# EAGLE design BPM_ver1 (EAGLE 9.6.2)
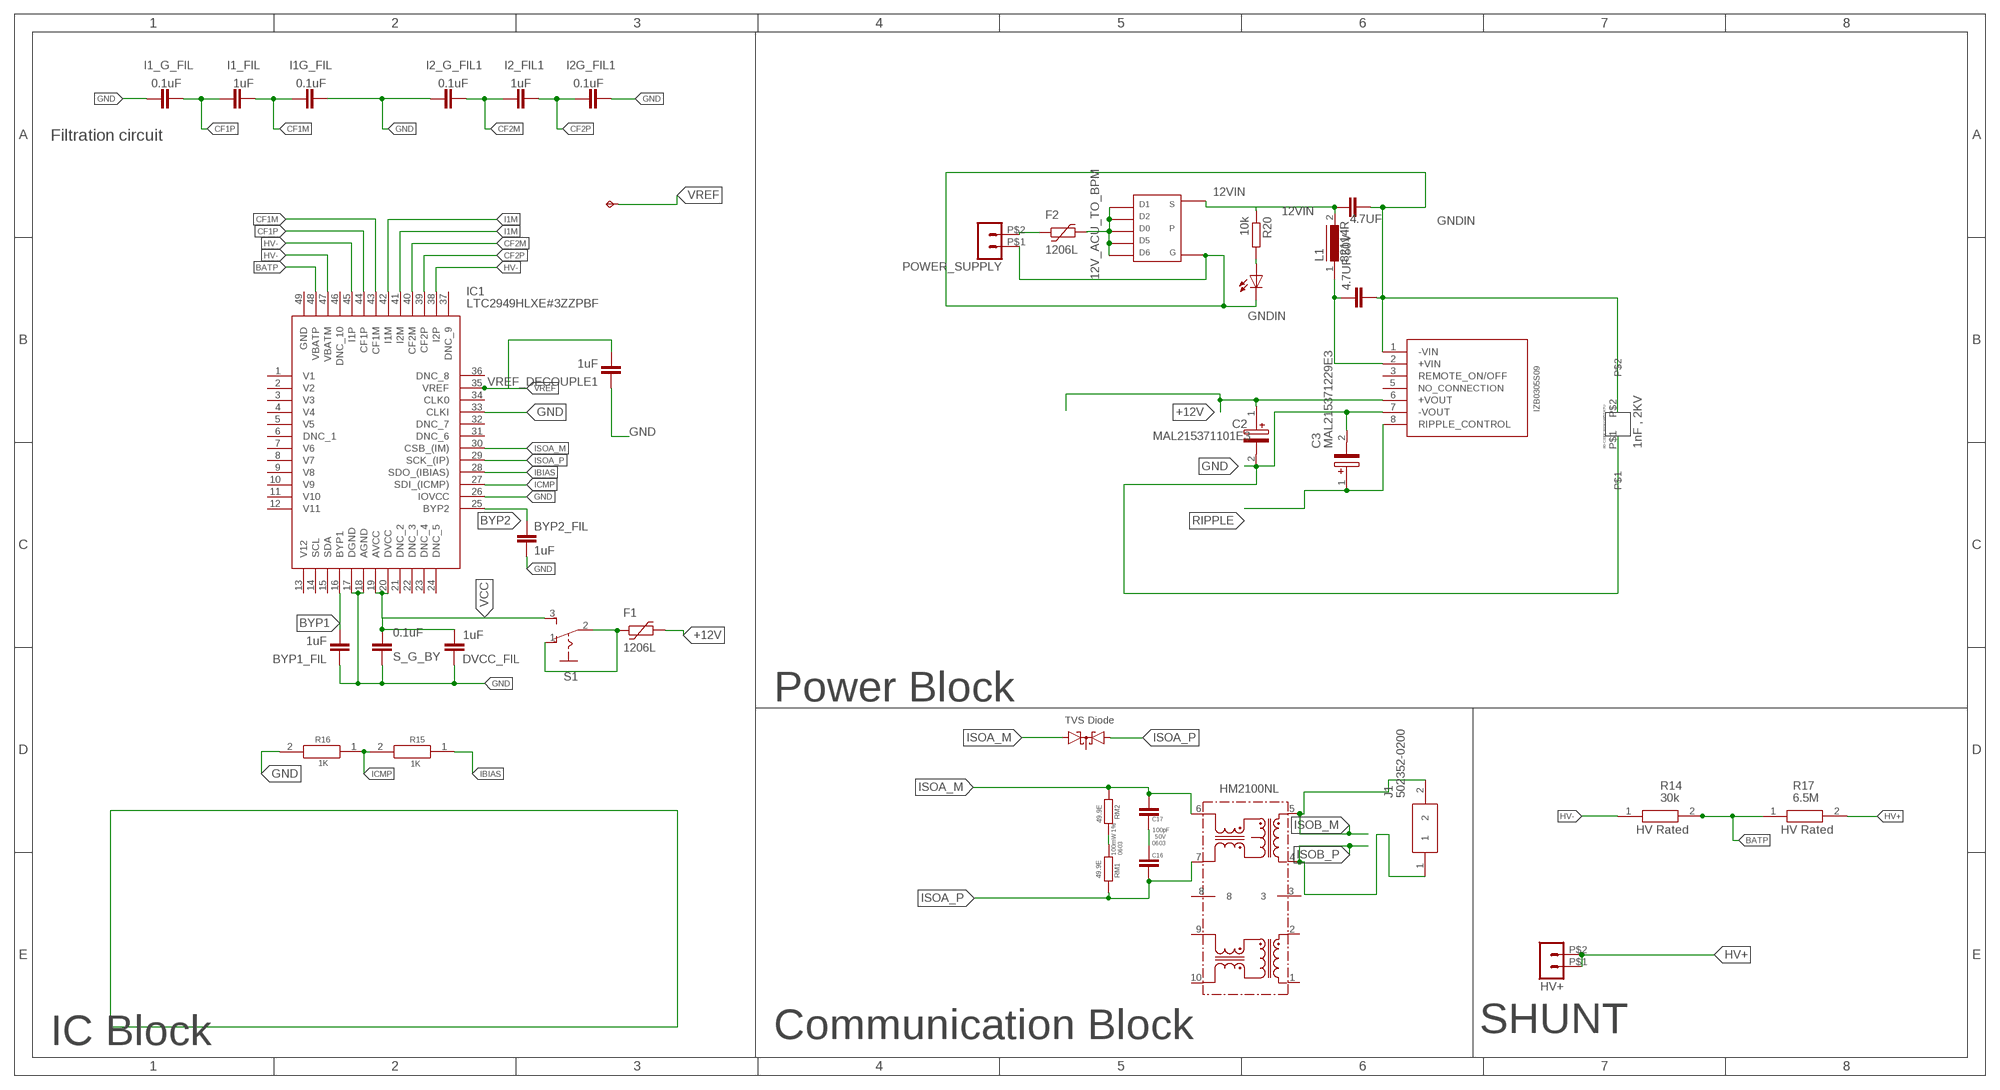
[diagram p0: schematic, sheet 1]

## Parts
4.7UF  C-EUC1206  [C1206]
4.7UF,50V  C-EUC1206  [C1206]
BYP1_FIL  1uF  C-EUC0603  [C0603]
BYP2_FIL  1uF  C-EUC0603  [C0603]
C2  MAL215371101E3  [CAPAE1060X1060N]
C3  MAL215371229E3  [CAPAE860X680N]
C15  TPPAD1-13  [P1-13]
C16  100pF  C-EUC0603  [C0603]
C17  100pF  C-EUC0603  [C0603]
DVCC_FIL  1uF  C-EUC0603  [C0603]
F1  1206L  [1206L]
F2  1206L  [1206L]
HM2100NL  HM2100NL  [HM2100NL]
HV+  MOLEX2PIN43650-0200  [43650-0200]
I1_FIL  1uF  C-EUC0603  [C0603]
I1_G_FIL  0.1uF  C-EUC0603  [C0603]
I1G_FIL  0.1uF  C-EUC0603  [C0603]
I2_FIL1  1uF  C-EUC0603  [C0603]
I2_G_FIL1  0.1uF  C-EUC0603  [C0603]
I2G_FIL1  0.1uF  C-EUC0603  [C0603]
IC1  LTC2949HLXE#3ZZPBF  [QFP50P900X900X160-49N]
IM1  TVS  BAS40-05  [SOT23]
J1  502352-0200  [5023520200]
L1  82114R  [82114R]
POWER_SUPPLY  MOLEX2PIN43045-0212  [43045-0212]
PWR_LED  LED-FKIT-1206  [FKIT-LED-1206]
R14  30k  HV73V2BTTD6494F  [RESC3216X70N]
R15  1K  CRCW06031K00FKEC  [RESC1608X50N]
R16  1K  CRCW06031K00FKEC  [RESC1608X50N]
R17  6.5M  HV73V2BTTD6494F  [RESC3216X70N]
R20  10k  R-EU_R0805  [R0805]
RM1  49.9E  R-EU_R0603  [R0603]
RM2  49.9E  R-EU_R0603  [R0603]
S1  STS121PC04  [STS121PC04]
S_G_BY  0.1uF  C-EUC0603  [C0603]
U$1  BPM_CONV  [BPM_CONV]
U$2  80-C330C102KGR5TATU  [80-C330C102KGR5TATU]
U$10  TSOP-6_PMOS  [TSOP-6_PMOS]
VREF_DECOUPLE1  1uF  C-EUC0603  [C0603]

## Nets
12V_ACU_TO_BPM: F2.P$2 U$10.1 U$10.2 U$10.5 U$10.6 U$10.D(D0)
12VIN: 4.7UF.1 L1.2 R20.1 U$10.S
+12V: C2.1(+) F1.P$2 U$1.6(+VOUT)
BATP: IC1.48(VBATP) R14.2 R17.1
BYP1: BYP1_FIL.2 IC1.16(BYP1)
BYP2: BYP2_FIL.1 IC1.25(BYP2)
CF1M: I1_FIL.1 I1G_FIL.1 IC1.43(CF1M)
CF1P: I1_FIL.2 I1_G_FIL.2 IC1.44(CF1P)
CF2M: I2_FIL1.2 I2_G_FIL1.1 IC1.40(CF2M)
CF2P: I2_FIL1.1 I2G_FIL1.1 IC1.39(CF2P)
GND: BYP1_FIL.1 BYP2_FIL.2 C2.2(-) C3.2(-) DVCC_FIL.1 I1_G_FIL.1 I1G_FIL.2 I2_G_FIL1.2 I2G_FIL1.2 IC1.17(DGND) IC1.18(AGND) IC1.26(IOVCC) IC1.33(CLKI) R16.2 S_G_BY.1 U$1.7(-VOUT) U$2.P$1 VREF_DECOUPLE1.1
GNDIN: 4.7UF,50V.2 4.7UF.2 POWER_SUPPLY.P$1 PWR_LED.C U$1.1(-VIN) U$2.P$2 U$10.G
HV+: HV+.P$1 HV+.P$2 R17.2
HV-: IC1.38(I2P) IC1.45(I1P) IC1.47(VBATM) R14.1
I1M: IC1.41(I2M) IC1.42(I1M)
IBIAS: IC1.28(SDO_(IBIAS)) R15.1
ICMP: IC1.27(SDI_(ICMP)) R15.2 R16.1
ISOA_M: C17.2 HM2100NL.6 IC1.30(CSB_(IM)) IM1.2(A2) RM2.1
ISOA_P: C16.1 HM2100NL.7 IC1.29(SCK_(IP)) IM1.1(A1) RM1.2
ISOB_M: HM2100NL.5 J1.2
ISOB_P: HM2100NL.4 J1.1
N$: RM1.1 RM2.2
N$1: 4.7UF,50V.1 L1.1 U$1.2(+VIN)
N$3: F2.P$1 POWER_SUPPLY.P$2
N$5: PWR_LED.A R20.2
N$8: F1.P$1 S1.1(O) S1.2(P)
N$15: C16.2 C17.1
RIPPLE: C3.1(+) U$1.8(RIPPLE_CONTROL)
VCC: DVCC_FIL.2 IC1.19(AVCC) IC1.20(DVCC) S1.3(S) S_G_BY.2
VREF: C15.TP IC1.35(VREF) VREF_DECOUPLE1.2
Unconnected: HM2100NL.1 HM2100NL.2 HM2100NL.3 HM2100NL.8 HM2100NL.9 HM2100NL.10 IC1.1(V1) IC1.2(V2) IC1.3(V3) IC1.4(V4) IC1.5(V5) IC1.6(DNC_1) IC1.7(V6) IC1.8(V7) IC1.9(V8) IC1.10(V9) IC1.11(V10) IC1.12(V11) IC1.13(V12) IC1.14(SCL) IC1.15(SDA) IC1.21(DNC_2) IC1.22(DNC_3) IC1.23(DNC_4) IC1.24(DNC_5) IC1.31(DNC_6) IC1.32(DNC_7) IC1.34(CLK0) IC1.36(DNC_8) IC1.37(DNC_9) IC1.46(DNC_10) IC1.49(GND) IM1.3(C) U$1.3(REMOTE_ON/OFF)

## Notes on the sheet
- Filtration circuit
- Power Block
- TVS Diode
- HV Rated | HV Rated
- 50V
  0603
- 100mW 1%
  0603
- IC Block | Communication Block | SHUNT

## Library data of the parts
4.7UF 4.7UF,50V = IIT_BOMBAY_Racing:C-EU: CAPACITOR, European symbol
BYP1_FIL BYP2_FIL DVCC_FIL I1_FIL I1_G_FIL I1G_FIL I2_FIL1 I2_G_FIL1 I2G_FIL1 S_G_BY VREF_DECOUPLE1 = rcl:C-EU: CAPACITOR, European symbol; SPICEPREFIX: C
C2 = SamacSys_Parts:MAL215371101E3: Aluminum Electrolytic Capacitors - SMD 100uF 50volts Source: Datasheet <https://datasheet.datasheetarchive.com/originals/distributors/DKDS-23/453117.pdf>; DESCRIPTION: Aluminum Electrolytic Capacitors - SMD 100uF 50volts; HEIGHT: 10.6mm; MANUFACTURER_NAME: Vishay; MANUFACTURER_PART_NUMBER: MAL215371101E3; MOUSER_PART_NUMBER: 594-MAL215371101E3; MOUSER_PRICE-STOCK: https://www.mouser.co.uk/ProductDetail/Vishay-BC-Components/MAL215371101E3?qs=qmStTZH4TzkcbcK0Zbtrsw%3D%3D
C3 = SamacSys_Parts:MAL215371229E3: Aluminum Electrolytic Capacitors - SMD 50V 22uF 20% Source: Datasheet <https://www.vishay.com/docs/28388/153crv.pdf>; DESCRIPTION: Aluminum Electrolytic Capacitors - SMD 50V 22uF 20%; HEIGHT: 6.8mm; MANUFACTURER_NAME: Vishay; MANUFACTURER_PART_NUMBER: MAL215371229E3; MOUSER_PART_NUMBER: 594-MAL215371229E3; MOUSER_PRICE-STOCK: https://www.mouser.co.uk/ProductDetail/Vishay-BC-Components/MAL215371229E3?qs=qmStTZH4TzmrNC0jpxbHVw%3D%3D
C15 = testpad:TP: Test pad
C16 C17 = resistor:C-EU: CAPACITOR, European symbol; MID: GCD188R71H103KA01D
F1 F2 = IIT_BOMBAY_Racing:1206L
HM2100NL = HM2100NL:HM2100NL
HV+ POWER_SUPPLY = IIT_BOMBAY_Racing2 (1):MOLEX2PIN: Molex - Micro-Fit 3.0 Series connector, 3.00mm (0.118") pitch header, 2 positions.
IC1 = SamacSys_Parts:LTC2949HLXE#3ZZPBF: Battery Management 60V Bat Gas Gauge w/ Temp, V & C Measure Source: Datasheet <https://www.analog.com/media/en/technical-documentation/data-sheets/LTC2949.pdf>; DESCRIPTION: Battery Management 60V Bat Gas Gauge w/ Temp, V & C Measure; HEIGHT: 1.6mm; MANUFACTURER_NAME: Analog Devices; MANUFACTURER_PART_NUMBER: LTC2949HLXE#3ZZPBF; MOUSER_PART_NUMBER: 584-949HLXE#3ZZPBF; MOUSER_PRICE-STOCK: https://www.mouser.co.uk/ProductDetail/Analog-Devices-Linear-Technology/LTC2949HLXE3ZZPBF?qs=wnTfsH77Xs63l8yDYlqztA%3D%3D
IM1 = diode:BAS40-05: Silicon Schottky Diodes General-purpose diode for high-speed switching
J1 = SamacSys_Parts:502352-0200: Molex DURACLIK 502352, 2mm Pitch, 2 Way, 1 Row, Right Angle PCB Header, Surface Mount Source: Datasheet <https://www.molex.com/pdm_docs/sd/5023520200_sd.pdf>; DESCRIPTION: Molex DURACLIK 502352, 2mm Pitch, 2 Way, 1 Row, Right Angle PCB Header, Surface Mount; HEIGHT: mm; MANUFACTURER_NAME: Molex; MANUFACTURER_PART_NUMBER: 502352-0200; MOUSER_PART_NUMBER: 538-502352-0200; MOUSER_PRICE-STOCK: https://www.mouser.co.uk/ProductDetail/Molex/502352-0200?qs=cPOO8qjhL6OPJnOOkJoW%252Bw%3D%3D
L1 = inductors:82114R: INDUCTOR; SPICEPREFIX: L
PWR_LED = IIT_BOMBAY_Racing:LED: LEDs Standard schematic elements and footprints for 5mm, 3mm, 1206, and 0603 sized LEDs. 5mm - Spark Fun Electronics SKU : COM-00529 (and others)
R14 R17 = SamacSys_Parts:HV73V2BTTD6494F: Thick Film Resistors - SMD 6490000Ohms 1% 1206 TCR=100 AEC-Q200 Source: Datasheet <https://www.mouser.ch/datasheet/2/219/HV73V-958787.pdf>; DESCRIPTION: Thick Film Resistors - SMD 6490000Ohms 1% 1206 TCR=100 AEC-Q200; HEIGHT: 0.7mm; MANUFACTURER_NAME: KOA Speer; MANUFACTURER_PART_NUMBER: HV73V2BTTD6494F
R15 R16 = SamacSys_Parts:CRCW06031K00FKEC: VISHAY - CRCW06031K00FKEC - RES, AEC-Q200, THICK FILM, 1K, 0.1W, 0603 Source: Datasheet <http://www.vishay.com/docs/20035/dcrcwe3.pdf>; ARROW_PART_NUMBER: CRCW06031K00FKEC; ARROW_PRICE-STOCK: https://www.arrow.com/en/products/crcw06031k00fkec/vishay; DESCRIPTION: VISHAY - CRCW06031K00FKEC - RES, AEC-Q200, THICK FILM, 1K, 0.1W, 0603; HEIGHT: 0.5mm; MANUFACTURER_NAME: Vishay; MANUFACTURER_PART_NUMBER: CRCW06031K00FKEC; MOUSER_PART_NUMBER: 71-CRCW06031K00FKEC; MOUSER_PRICE-STOCK: https://www.mouser.co.uk/ProductDetail/Vishay-Dale/CRCW06031K00FKEC?qs=LTJBsG9vER03gQprIr9%2F9w%3D%3D
R20 = IIT_BOMBAY_Racing:R-EU_: RESISTOR, European symbol
RM1 RM2 = resistor:R-EU_: RESISTOR, European symbol; MID: CRCW0603120RFKEAHP
S1 = switches:STS121PC04: SLIDING SWITCH Distributor Buerklin, 11G810
U$1 = BPM_CONV:BPM_CONV
U$2 = 80-C330C102KGR5TATU:80-C330C102KGR5TATU
U$10 = TSOP-6_MOS:TSOP-6_PMOS

## Net classes
0 default: width 0.127 mm, drill 0.127 mm, clearance 0.127 mm
1 differential: width 0.305 mm

## Board
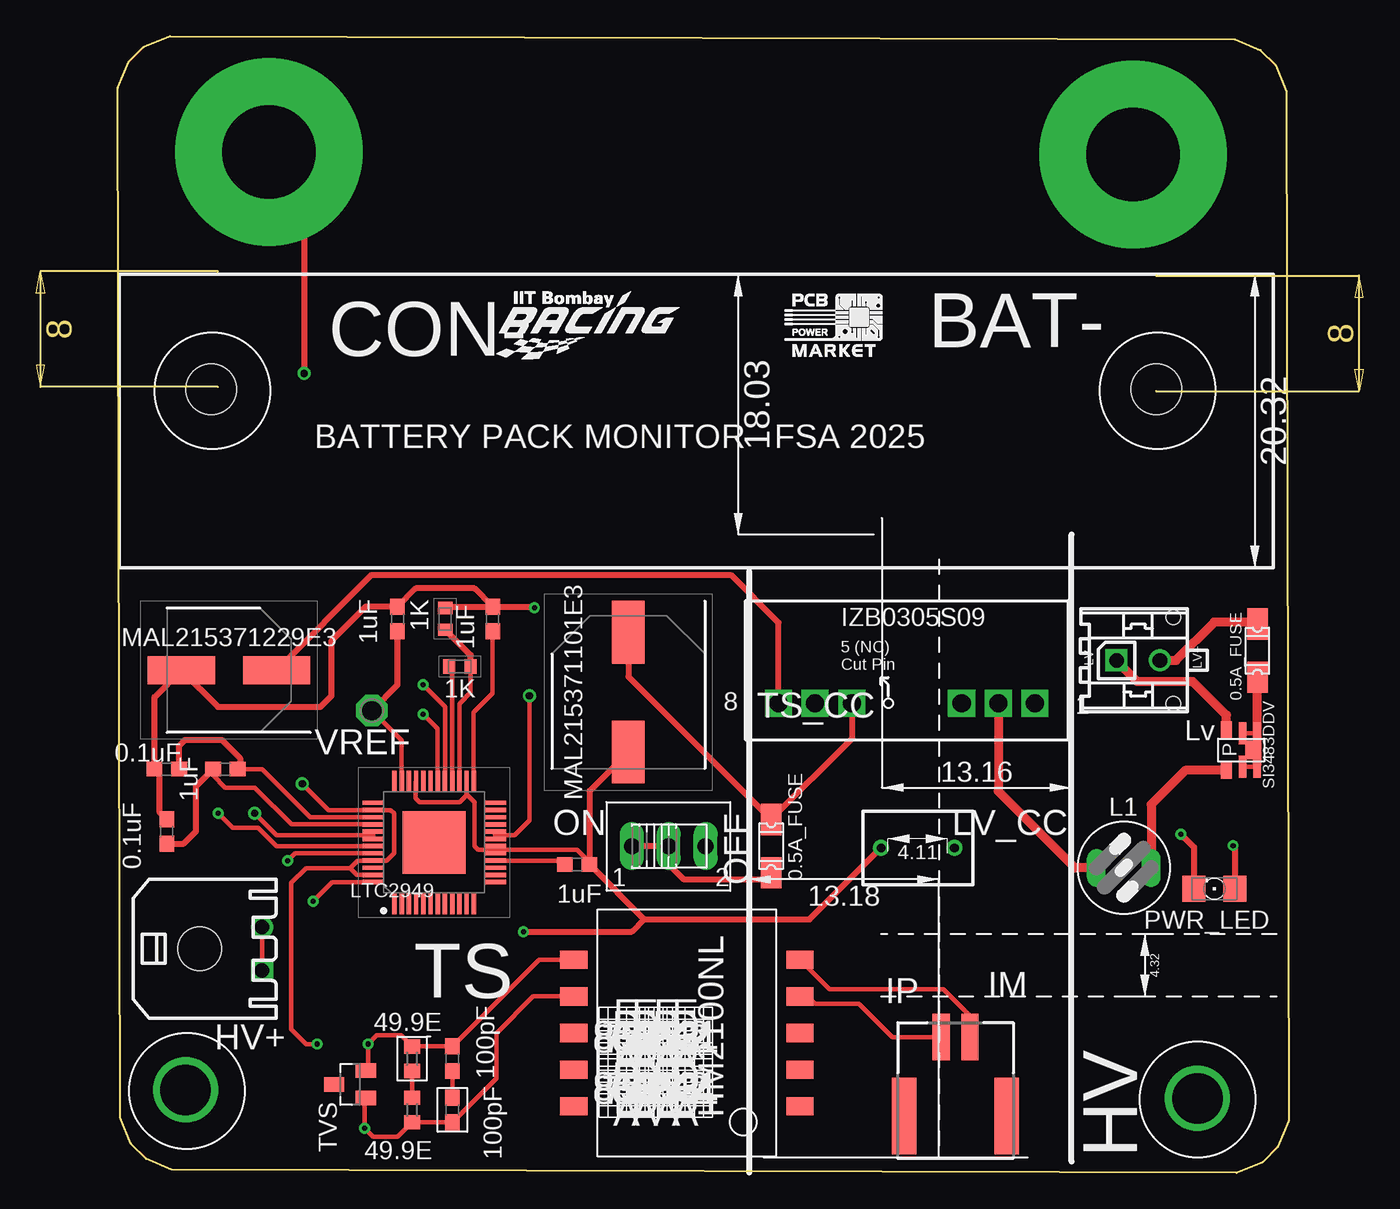
[diagram p1: board, top side]
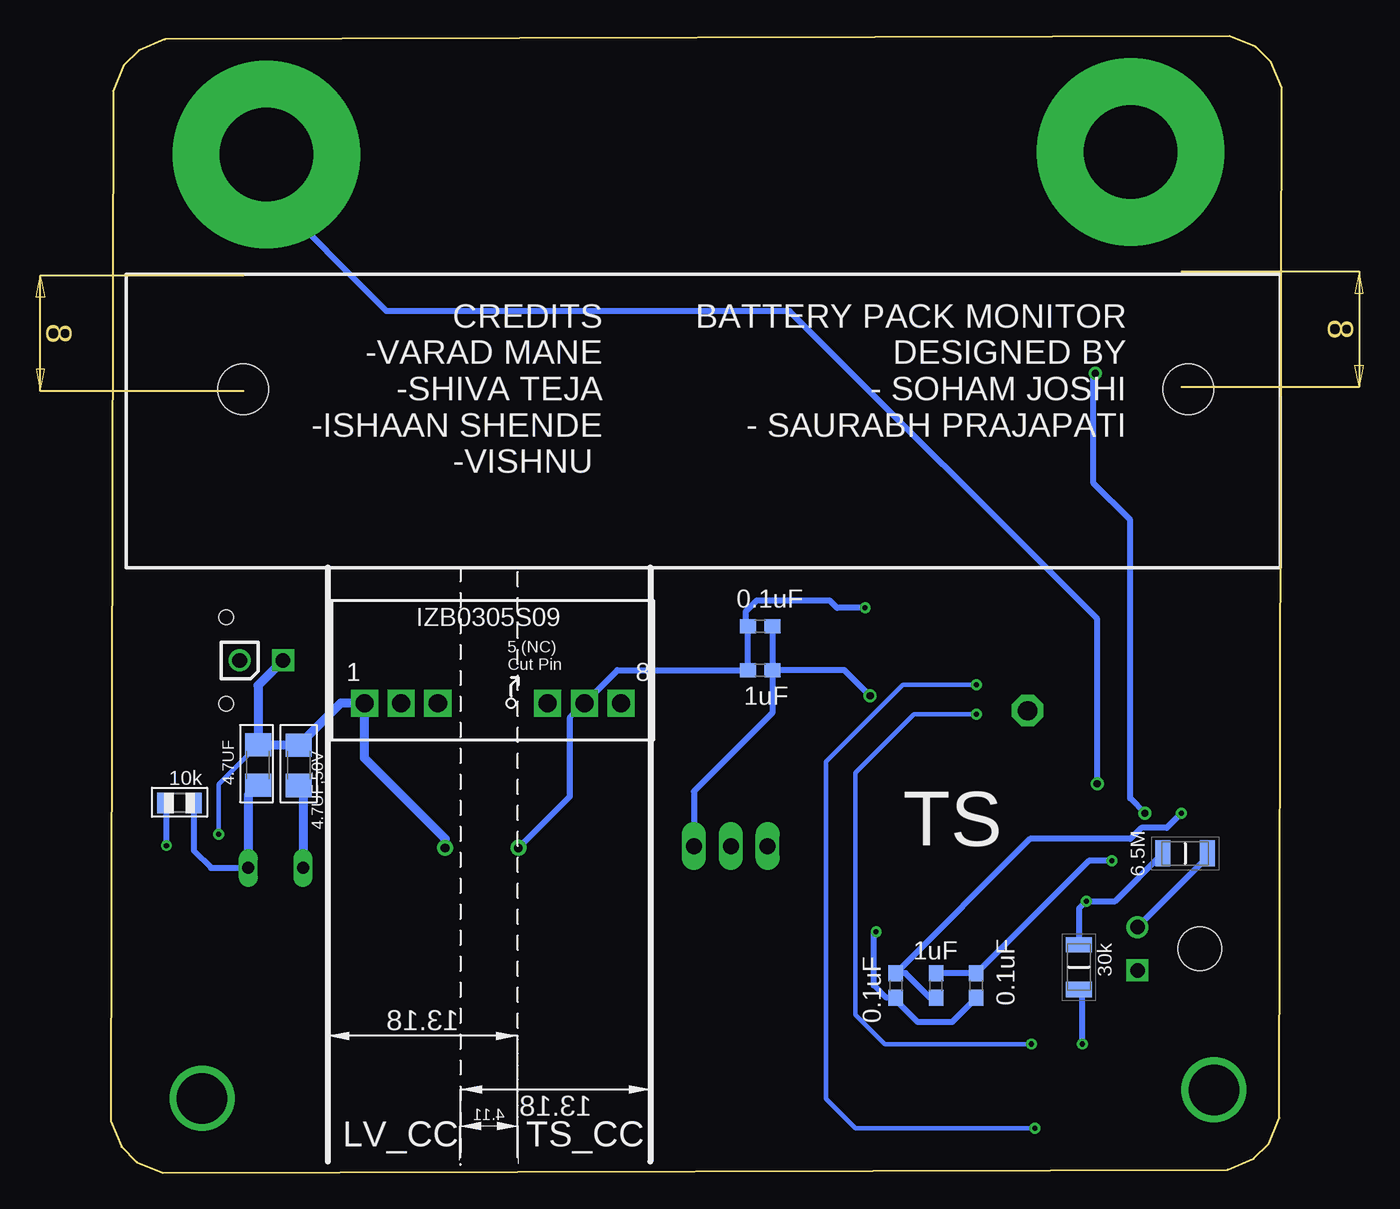
[diagram p2: board, bottom side, seen from below]

Size 81.19 x 78.79 mm. Coordinates in mm from the lower left corner, seen from the top.
Outline: 3.6,78.79 77.44,78.56 79.23,77.82 80.28,76.77 81.03,74.97 81.19,3.6 80.44,1.8 79.39,0.74 77.59,0 3.74,0.23 1.95,0.98 0.9,2.03 0.16,3.82 0,75.19 0.74,77 1.8,78.05 3.6,78.79
Copper layers (1*16): Top 0.035mm / dielectric 1.5mm / Bottom 0.035mm
Design rules "default": minimum track width 6mil, minimum drill 0.35mm, track to track 6mil, track to pad 6mil, pad to pad 6mil, via to via 6mil, smd to smd 6mil, copper to edge 40mil, drill to drill 6mil, minimum pad ring 10mil, minimum via ring 8mil, stop-mask expansion 4mil, vias tented up to drill 0mil, thermal gap 10mil
Holes 3.5 mm at 6.48,54.3 72.01,54.3

### Footprints (pad centres in the part's own frame; a part is rotated, then mirrored left to right if it is on the bottom)
C1206 = smd 1.6 x 1.8: 1 -1.4,0; 2 1.4,0
C0603 = smd 1.1 x 1: 1 -0.85,0; 2 0.85,0
CAPAE1060X1060N = smd 4.35 x 2.25: 1 -4.15,0; 2 4.15,0
CAPAE860X680N = smd 4.65 x 1.95: 1 -3.3,0; 2 3.3,0
P1-13 = drill 1.321 pad 2.159 octagon: TP 0,0
1206L = smd 2.16 x 1.4: P$1 -1.85,0; P$2 1.85,0
HM2100NL = smd 1.27 x 1.89: 1 -5.08,-7.84; 2 -2.54,-7.84; 3 0,-7.84; 4 2.54,-7.84; 5 5.08,-7.84; 6 5.08,7.84; 7 2.54,7.84; 8 0,7.84; 9 -2.54,7.84; 10 -5.08,7.84
43650-0200 = drill 1.02 square: P$1 1.5,4.32 | drill 1.02: P$2 -1.5,4.32 | hole 3: 0,0
QFP50P900X900X160-49N = smd 1.475 x 0.3: 1 -4.238,2.75; 2 -4.238,2.25; 3 -4.238,1.75; 4 -4.238,1.25; 5 -4.238,0.75; 6 -4.238,0.25; 7 -4.238,-0.25; 8 -4.238,-0.75; 9 -4.238,-1.25; 10 -4.238,-1.75; 11 -4.238,-2.25; 12 -4.238,-2.75; 25 4.238,-2.75; 26 4.238,-2.25; 27 4.238,-1.75; 28 4.238,-1.25; 29 4.238,-0.75; 30 4.238,-0.25; 31 4.238,0.25; 32 4.238,0.75; 33 4.238,1.25; 34 4.238,1.75; 35 4.238,2.25; 36 4.238,2.75 | smd 0.3 x 1.475: 13 -2.75,-4.238; 14 -2.25,-4.238; 15 -1.75,-4.238; 16 -1.25,-4.238; 17 -0.75,-4.238; 18 -0.25,-4.238; 19 0.25,-4.238; 20 0.75,-4.238; 21 1.25,-4.238; 22 1.75,-4.238; 23 2.25,-4.238; 24 2.75,-4.238; 37 2.75,4.238; 38 2.25,4.238; 39 1.75,4.238; 40 1.25,4.238; 41 0.75,4.238; 42 0.25,4.238; 43 -0.25,4.238; 44 -0.75,4.238; 45 -1.25,4.238; 46 -1.75,4.238; 47 -2.25,4.238; 48 -2.75,4.238 | smd 4.35 x 4.35: 49 0,0
SOT23 = smd 1 x 1.4: 1 -0.95,-1.1; 2 0.95,-1.1; 3 0,1.1
5023520200 = smd 1.2 x 3.2: 1 -1,-1; 2 1,-1 | smd 1.7 x 5.3: 3 -3.55,-6.48; 4 3.55,-6.48
82114R = drill 0.813 long: 1 0,1.905; 2 0,-1.905
43045-0212 = drill 1.02 square: P$1 0,0 | drill 1.02: P$2 0,3 | hole 1.02: 3,3.94; -3,3.94
FKIT-LED-1206 = smd 1.6 x 1.803: A -1.422,0; C 1.422,0
RESC3216X70N = smd 1.05 x 1.8: 1 -1.55,0; 2 1.55,0
RESC1608X50N = smd 0.85 x 1: 1 -0.75,0; 2 0.75,0
R0805 = smd 1.1 x 1.4: 1 -1,0; 2 1,0
R0603 = smd 1 x 1.1: 1 -0.85,0; 2 0.85,0
STS121PC04 = drill 1.118 long: 1 -3.81,0; 2 -1.27,0; 3 1.29,0
BPM_CONV = drill 1.25 square: 1 0,0; 2 -2.54,0; 3 -5.08,0; 6 -12.7,0; 7 -15.24,0; 8 -17.78,0
80-C330C102KGR5TATU = drill 0.6: P$1 -2.54,0; P$2 2.54,0
TSOP-6_PMOS = smd 0.5 x 1.92: 1 -1,-0.96; 6 -1,0.96 | smd 0.5 x 1.52: 2 0,-1.16; 5 0,1.16 | smd 0.635 x 1.27: D -0.5,0 | smd 0.75 x 1.2: G 1.13,-1.4; S 1.13,1.4

### Placement (x,y rotation side)
4.7UF  70.99,28.27 90 bottom
4.7UF,50V  68.15,28.25 90 bottom
BYP1_FIL  31.84,21.38 180 top
BYP2_FIL  26,38.39 90 top
C2  35.4,33.31 270 top
C3  7.71,34.84 180 top
C15  17.62,32.04 90 top
C16  23.21,4.36 90 top
C17  23.21,7.91 90 top
DVCC_FIL  36.16,34.84 0 bottom
F1  45.3,22.64 90 top
F2  79.03,36.19 270 top
HM2100NL  39.46,9.69 90 top
HV+  5.68,15.53 270 top
I1_FIL  23.97,12.99 90 bottom
I1_G_FIL  21.18,12.99 90 bottom
I1G_FIL  26.76,12.99 270 bottom
I2_FIL1  7.46,27.98 180 top
I2_G_FIL1  3.39,23.66 90 top
I2G_FIL1  3.39,27.98 180 top
IC1  21.94,22.9 90 top
IM1  16.09,6.14 90 top
J1  58.08,10.41 0 top
L1  69.76,21.14 90 top
POWER_SUPPLY  69.25,35.52 270 top
PWR_LED  76.04,19.69 180 top
R14  14.06,14.26 90 bottom
R15  23.71,35.09 0 top
R16  22.7,38.39 90 top
R17  6.7,22.14 0 bottom
R20  76.43,25.63 180 bottom
RM1  20.41,4.36 270 top
RM2  20.41,7.91 270 top
S1  39.46,22.64 0 top
S_G_BY  36.16,37.89 0 bottom
U$1  63.59,32.55 0 top
U$2  55.47,22.52 0 top
U$6  LOGO_PCBPOWER  [270X170]  46.19,56.55 0 top
U$10  78,29.3 180 top
U$22  [RACING_LOGO_190MIL]  26.03,56.2 0 top
VREF_DECOUPLE1  19.4,38.39 270 top

### Tracks (layer width: path | path; a pad name or v marks a point on that pad's centre or on a via)
12V_ACU_TO_BPM
  Top 0.305: U$10.2 78.8,30.46 U$10.1 79,29.8 U$10.D 79,28.8 U$10.6 78.8,28.14 U$10.5
  Top 0.61: F2.P$2 79,34.31 U$10.6
12VIN
  Top 0.61: U$10.S 74.02,27.9 71.66,25.55 L1.2
  Bottom 0.406: R20.1 75.43,22.34 74.23,21.14 L1.2
  Bottom 0.61: 4.7UF.1 71.66,26.19 L1.2
+12V
  Top 0.406: C2.1 35.4,34.4 F1.P$2 50.89,30.08 U$1.6
BATP  (via drill 0.35)
  Top 0.305: IC1.48 14.87,20.15 v13.55,18.83
  Bottom 0.406: R14.2 14.06,18.33 v13.55,18.83 11.55,18.83 R17.1
BYP1
  Top 0.305: IC1.16 30.72,21.65 BYP1_FIL.2
BYP2
  Top 0.305: IC1.25 24.69,31.91 26,33.22 BYP2_FIL.1
CF1M  (via drill 0.35)
  Top 0.305: IC1.43 11.01,22.65 9.74,23.92 7.97,23.92 v6.95,24.93
  Bottom 0.406: v6.95,24.93 7.97,23.92 9.74,23.92 10.51,23.15 17.45,23.15 I1G_FIL.1 26.09,13.84 24.39,12.14 I1_FIL.1
CF1P  (via drill 0.35)
  Top 0.305: IC1.44 12.3,22.15 v11.78,21.63
  Bottom 0.406: v11.78,21.63 13.39,21.63 I1_G_FIL.2 I1_FIL.2
CF2M
  Top 0.305: IC1.40 12.05,24.15 9.49,26.71 7.46,26.71 6.61,27.56 I2_FIL1.2
  Top 0.406: I2_FIL1.2 5.43,26.8 5.43,23.66 4.58,22.81 I2_G_FIL1.1
CF2P
  Top 0.305: IC1.39 13.33,24.65 10,27.98 8.47,27.98 I2_FIL1.1
  Top 0.406: I2G_FIL1.1 4.24,29.59 4.66,30.01 7.21,30.01 8.47,28.74 8.47,27.98
GND  (via drill 0.35)
  Top 0.305: 26.17,22.39 IC1.17 26.42,22.39 31.84,22.39 32.69,21.54 BYP1_FIL.1 | 26.17,22.39 IC1.18 | 24.19,26.17 23.71,25.69 20.92,25.69 20.67,25.95 20.67,27.12 IC1.33 | 24.19,26.17 IC1.26 | 24.19,26.17 24.26,26.17 24.73,25.69 24.73,22.64 24.98,22.39 26.17,22.39
  Top 0.406: BYP2_FIL.2 24.73,40.51 20.67,40.51 VREF_DECOUPLE1.1 17.2,39.24 14.82,36.87 14.82,33.06 14.06,32.3 6.95,32.3 C3.2 2.54,32.97 I2G_FIL1.2 2.89,27.74 2.89,25.02 I2_G_FIL1.2 | R16.2 22.8,39.24 BYP2_FIL.2 | 36.5,17.57 BYP1_FIL.1 32.69,26.46 C2.2 | U$2.P$1 47.97,17.57 36.5,17.57 | BYP2_FIL.2 28.79,39.24 v28.88,39.16 | v28.12,16.71 35.65,16.71 36.5,17.57
  Bottom 0.406: U$2.P$1 49.37,26.07 49.37,31.54 U$1.7 46.07,34.84 DVCC_FIL.1 37.01,37.63 | I1_G_FIL.1 22.86,10.45 25.24,10.45 26.76,11.98 I1G_FIL.2 27.44,12.14 28.29,12.99 28.29,16.55 v28.12,16.71 | 37.01,37.63 S_G_BY.1 | v28.88,39.16 30.83,39.16 31.33,39.66 36.41,39.66 37.18,38.9 37.18,37.8 37.01,37.63
GND_1  (via drill 3.5)
  other vias: 4.7,5.76
GND_3  (via drill 3.5)
  other vias: 74.86,5.17
GNDIN  (via drill 0.35)
  Top 0.406: v73.72,23.47 74.62,22.58 PWR_LED.C
  Top 0.61: U$10.G 76.87,31.72 74.53,34.05 70.69,34.05 69.25,35.5 POWER_SUPPLY.P$1
  Bottom 0.305: v73.72,23.47 73.72,26.93 4.7UF.2
  Bottom 0.61: 4.7UF.2 70.97,29.65 4.7UF,50V.2 65.25,32.55 U$1.1 63.59,28.74 58.01,23.15 U$2.P$2 | 69.52,35.25 POWER_SUPPLY.P$1 70.99,33.78 4.7UF.2 | 4.7UF.2 70.99,29.85
HV+
  Top 0.305: HV+.P$2 HV+.P$1
  Bottom 0.406: HV+.P$2 5.15,21.89 R17.2
HV-  (via drill 0.35, 0.5 pad 0.65, 6.5 pad 13)
  Top 0.305: 16.09,21.12 16.62,21.65 IC1.45 18.66,21.65 19.14,22.14 19.14,24.93 18.93,25.15 IC1.38 14.61,25.15 v12.79,26.96 | 16.09,21.12 16.57,20.65 IC1.47 | 16.09,21.12 13.05,21.12 12.03,20.11 12.03,9.95 13.05,8.93 v13.81,8.93
  Bottom 0.406: v12.79,26.96 12.79,38.39 34.13,59.73 62.07,59.73 70.4,68.06 v70.4,70.58 | v13.81,8.93 13.81,12.46 R14.1
I1M  (via drill 0.5 pad 0.65, 6.5 pad 13)
  Top 0.305: IC1.42 IC1.41 17.45,23.39 11.03,23.39 v9.49,24.93
  Top 0.406: v12.92,55.41 12.92,68.41 10.57,70.76 v10.48,70.76
  Bottom 0.406: v9.49,24.93 10.51,25.95 10.51,45.25 13.05,47.79 13.05,55.28 v12.92,55.41
IBIAS
  Top 0.305: IC1.28 23.19,34.87 R15.1
ICMP
  Top 0.305: IC1.27 23.69,32.52 24.48,33.31 24.48,35.08 R15.2
  Top 0.406: R15.2 24.46,35.88 23.59,36.75 R16.1
ISOA_M  (via drill 0.35)
  Top 0.305: IM1.2 17.36,7.25 v17.36,8.93 17.96,9.53 19.65,9.53 RM2.1 C17.2 29.21,14.77 HM2100NL.6 | IC1.30 22.19,30.78 v21.18,31.79
  Bottom 0.305: v21.18,31.79 25.49,31.79 29.56,27.72 29.56,10.96 27.52,8.93 v17.36,8.93
ISOA_P  (via drill 0.35)
  Top 0.305: IM1.1 17.11,5.1 v17.11,3.09 17.71,2.49 19.4,2.49 RM1.2 C16.1 26.25,6.55 26.25,9.69 28.79,12.23 HM2100NL.7 | IC1.29 22.69,32.31 v21.18,33.82
  Bottom 0.305: v21.18,33.82 26.25,33.82 31.59,28.49 31.59,5.12 29.56,3.09 v17.11,3.09
ISOB_M
  Top 0.305: J1.2 59.08,10.9 57.24,12.74 49.34,12.74 HM2100NL.5
ISOB_P
  Top 0.305: J1.1 53.71,9.41 51.4,11.72 48.35,11.72 47.84,12.23 HM2100NL.4
N$
  Top 0.305: RM1.1 RM2.2
N$1
  Top 0.61: L1.1 66.36,21.14 61.05,26.46 U$1.2
  Bottom 0.61: 4.7UF,50V.1 67.85,26.55 L1.1
N$3
  Top 0.61: F2.P$1 78.9,38.16 76.02,38.16 73.37,35.52 POWER_SUPPLY.P$2
N$5  (via drill 0.35)
  Top 0.406: v77.33,22.69 77.46,22.56 PWR_LED.A
  Bottom 0.406: v77.33,22.69 77.33,25.53 R20.2
N$8
  Top 0.406: S1.1 S1.2 38.19,21.38 39.21,20.36 44.87,20.36 F1.P$1
N$15
  Top 0.305: C16.2 C17.1
RIPPLE
  Top 0.406: U$1.8 45.81,38.14 42.51,41.44 17.62,41.44 C3.1
VCC  (via drill 0.5 pad 0.65)
  Top 0.305: IC1.19 26.17,23.41 | 26.17,23.41 IC1.20 | 26.17,23.41 27.52,23.41 28.54,24.42 v28.54,33.06
  Bottom 0.406: v28.54,33.06 30.32,34.84 DVCC_FIL.2 | S_G_BY.2 DVCC_FIL.2 | DVCC_FIL.2 35.31,31.88 40.75,26.43 S1.3
VREF
  Top 0.305: IC1.35 19.69,29.97 C15.TP
  Top 0.406: C15.TP 19.4,33.82 VREF_DECOUPLE1.2

### Text on the board
tPlace: BATTERY PACK MONITOR FSA 2025 | TS_CC | LV_CC | TS | HV
bPlace: TS | TS_CC | LV_CC
tNames: BAT- | CON- | LV- | LV+ | VREF | 0.1uF | Lv | 0.5A_FUSE | 0.1uF | ON | OFF | LTC2949 | IP | IM | HV+
bNames: BATTERY PACK MONITOR / DESIGNED BY / - SOHAM JOSHI / - SAURABH PRAJAPATI | CREDITS / -VARAD MANE / -SHIVA TEJA / -ISHAAN SHENDE / -VISHNU | 1uF | 0.1uF